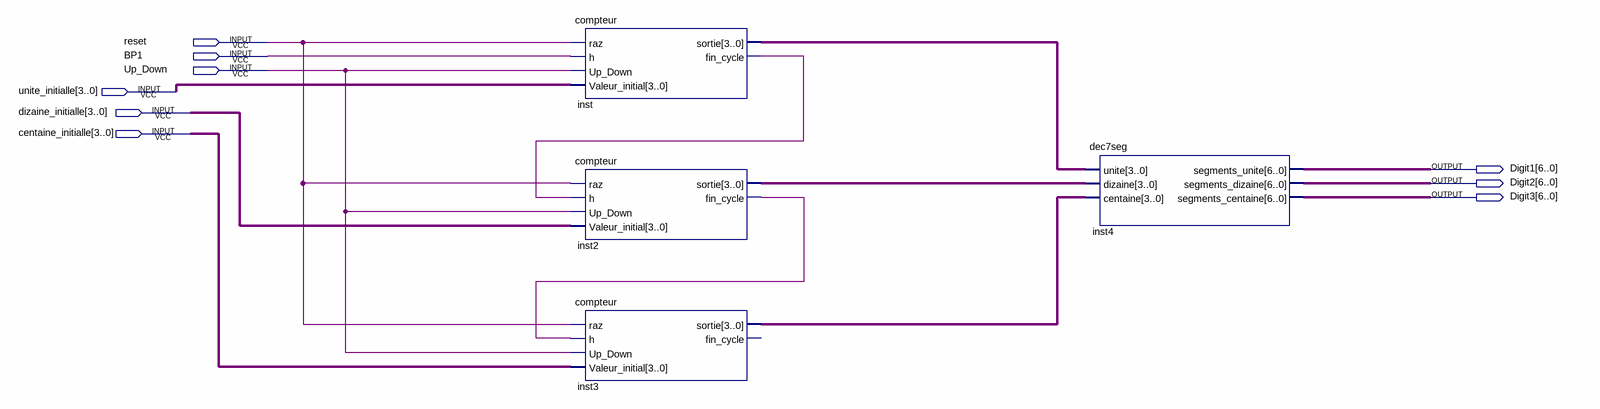
[diagram p0: schematic sheet]
// Quartus schematic interface.bdf as structural Verilog: 4 symbols, 9 pins
module \interface  (
  input  reset,
  input  BP1,
  input  Up_Down,
  input  [3:0] unite_initialle,
  input  [3:0] dizaine_initialle,
  input  [3:0] centaine_initialle,
  output [6:0] Digit1,
  output [6:0] Digit2,
  output [6:0] Digit3
);

  wire inst2_fin_cycle, inst_fin_cycle;
  wire [3:0] inst2_sortie, inst3_sortie, inst_sortie;

  compteur inst (
    .raz(reset), .h(BP1), .Up_Down(Up_Down), .Valeur_initial(unite_initialle), .sortie(inst_sortie),
    .fin_cycle(inst_fin_cycle));
  compteur inst2 (
    .raz(reset), .h(inst_fin_cycle), .Up_Down(Up_Down), .Valeur_initial(dizaine_initialle),
    .sortie(inst2_sortie), .fin_cycle(inst2_fin_cycle));
  compteur inst3 (
    .raz(reset), .h(inst2_fin_cycle), .Up_Down(Up_Down), .Valeur_initial(centaine_initialle),
    .sortie(inst3_sortie));  // open: fin_cycle
  dec7seg inst4 (
    .unite(inst_sortie), .dizaine(inst2_sortie), .centaine(inst3_sortie), .segments_unite(Digit1),
    .segments_dizaine(Digit2), .segments_centaine(Digit3));
endmodule
